# Altium schematic sheet pcuOut.SchDoc
size A3
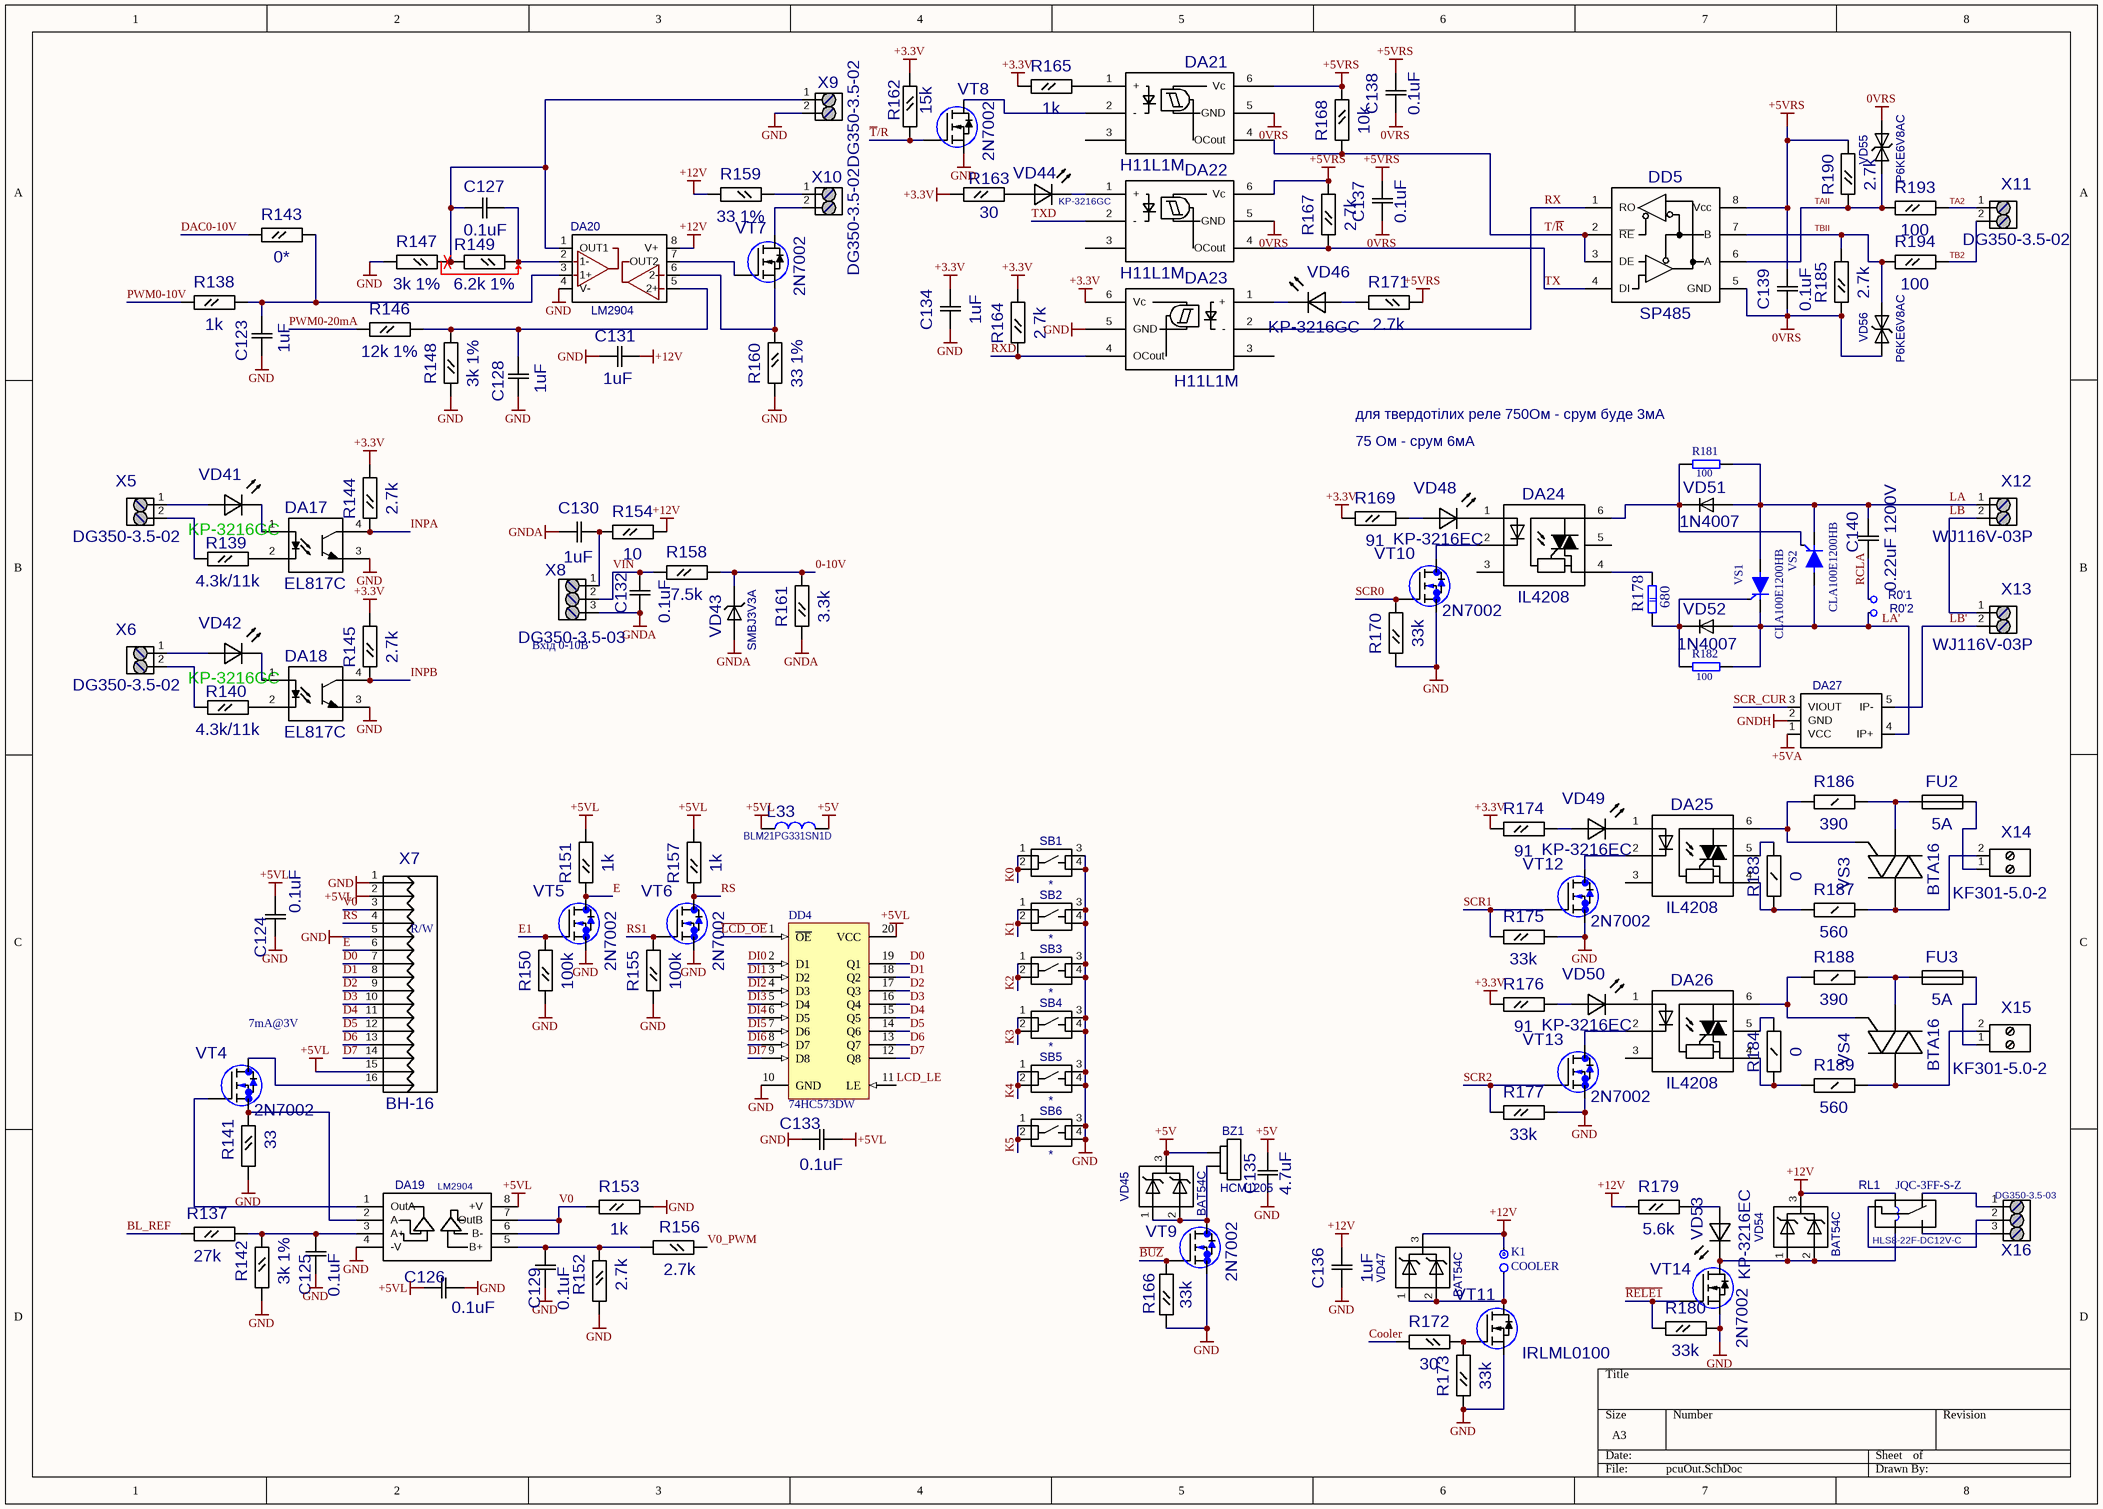
[diagram p0: pcuOut.SchDoc]

## Parts
BZ1  HCM1205  [D12_P7-62]
C123  value 1uF  [C0805]  (hidden comment: C0805)
C124  value 0.1uF  [C0805]  (hidden comment: C0805)
C125  value 0.1uF  [C0805]  (hidden comment: C0805)
C126  value 0.1uF  [C0805]  (hidden comment: C0805)
C127  value 0.1uF  [C0805]  (hidden comment: C0805)
C128  value 1uF  [C0805]  (hidden comment: C0805)
C129  value 0.1uF  [C0805]  (hidden comment: C0805)
C130  value 1uF  [C0805]  (hidden comment: C0805)
C131  value 1uF  [C0805]  (hidden comment: C0805)
C132  value 0.1uF  [C0805]  (hidden comment: C0805)
C133  value 0.1uF  [C0805]  (hidden comment: C0805)
C134  value 1uF  [C0805]  (hidden comment: C0805)
C135  value 4.7uF  [C1206]  (hidden comment: C1206)
C136  value 1uF  [C0805]  (hidden comment: C0805)
C137  value 0.1uF  [C0805]  (hidden comment: C0805)
C138  value 0.1uF  [C0805]  (hidden comment: C0805)
C139  value 0.1uF  [C0805]  (hidden comment: C0805)
C140  0.22uF 1200V  [CBB21]
DA17  EL817C  [DIL4SMD]
DA18  EL817C  [DIL4SMD]
DA19  value LM2904  [SO8-150]  (hidden comment: LM358D)
DA20  LM2904  [SO8-1.27]
DA21  H11L1M  [DIP6_SURFACE]
DA22  H11L1M  [DIP6_SURFACE]
DA23  H11L1M  [DIP6_SURFACE]
DA24  IL4208  [DIP6]
DA25  IL4208  [DIP6]
DA26  IL4208  [DIP6]
DA27  ACS758  [CB]  (value not drawn)
DD4  74HC573DW  [DW020_N]
DD5  SP485  [SO8-150]
FU2  value 5A  [FU_5x20]  (hidden comment: FUSE-D5)
FU3  value 5A  [FU_5x20]  (hidden comment: FUSE-D5)
K1  COOLER  [J1x2]
L33  BLM21PG331SN1D  [R0805]
R0'1  1mm  [PCB_hole_1mm]  (value not drawn)
R0'2  1mm  [PCB_hole_1mm]  (value not drawn)
R137  value 27k  [R0805]  (hidden comment: R0805)
R138  value 1k  [R0805]  (hidden comment: R0805)
R139  value 4.3k/11k  [R0805]  (hidden comment: R0805)
R140  value 4.3k/11k  [R0805]  (hidden comment: R0805)
R141  value 33  [R0805]  (hidden comment: R0805)
R142  value 3k 1%  [R0805]  (hidden comment: R0805)
R143  value 0*  [R0805]  (hidden comment: R0805)
R144  value 2.7k  [R0805]  (hidden comment: R0805)
R145  value 2.7k  [R0805]  (hidden comment: R0805)
R146  value 12k 1%  [R0805]  (hidden comment: R0805)
R147  value 3k 1%  [R0805]  (hidden comment: R0805)
R148  value 3k 1%  [R0805]  (hidden comment: R0805)
R149  value 6.2k 1%  [R0805]  (hidden comment: R0805)
R150  value 100k  [R0805]  (hidden comment: R0805)
R151  value 1k  [R0805]  (hidden comment: R0805)
R152  value 2.7k  [R0805]  (hidden comment: R0805)
R153  value 1k  [R0805]  (hidden comment: R0805)
R154  value 10  [R0805]  (hidden comment: R0805)
R155  value 100k  [R0805]  (hidden comment: R0805)
R156  value 2.7k  [R0805]  (hidden comment: R0805)
R157  value 1k  [R0805]  (hidden comment: R0805)
R158  value 7.5k  [R0805]  (hidden comment: R0805)
R159  value 33 1%  [R0805]  (hidden comment: R0805)
R160  value 33 1%  [R0805]  (hidden comment: R0805)
R161  value 3.3k  [R0805]  (hidden comment: R0805)
R162  value 15k  [R0805]  (hidden comment: R0805)
R163  value 30  [R0805]  (hidden comment: R0805)
R164  value 2.7k  [R0805]  (hidden comment: R0805)
R165  value 1k  [R0805]  (hidden comment: R0805)
R166  value 33k  [R0805]  (hidden comment: R0805)
R167  value 2.7k  [R0805]  (hidden comment: R0805)
R168  value 10k  [R0805]  (hidden comment: R0805)
R169  value 91  [R0805]  (hidden comment: R0805)
R170  value 33k  [R0805]  (hidden comment: R0805)
R171  value 2.7k  [R0805]  (hidden comment: R0805)
R172  value 30  [R0805]  (hidden comment: R0805)
R173  value 33k  [R0805]  (hidden comment: R0805)
R174  value 91  [R0805]  (hidden comment: R0805)
R175  value 33k  [R0805]  (hidden comment: R0805)
R176  value 91  [R0805]  (hidden comment: R0805)
R177  value 33k  [R0805]  (hidden comment: R0805)
R178  680  [R2W CF-700]
R179  value 5.6k  [R0805]  (hidden comment: R0805)
R180  value 33k  [R0805]  (hidden comment: R0805)
R181  100  [R0.5-400]
R182  100  [R0.5-400]
R183  value 0  [R1206]  (hidden comment: R1206)
R184  value 0  [R1206]  (hidden comment: R1206)
R185  value 2.7k  [R0805]  (hidden comment: R0805)
R186  value 390  [R1206]  (hidden comment: R1206)
R187  value 560  [R1206]  (hidden comment: R1206)
R188  value 390  [R1206]  (hidden comment: R1206)
R189  value 560  [R1206]  (hidden comment: R1206)
R190  value 2.7k  [R0805]  (hidden comment: R0805)
R193  value 100  [R0805]  (hidden comment: R0805)
R194  value 100  [R0805]  (hidden comment: R0805)
RL1  value HLS8-22F-DC12V-C  [RELAY833]  (hidden comment: RELEY833)
SB1  *  [DTSM-6]
SB2  *  [DTSM-6]
SB3  *  [DTSM-6]
SB4  *  [DTSM-6]
SB5  *  [DTSM-6]
SB6  *  [DTSM-6]
VD41  KP-3216GC  [KP-3216 Hole]
VD42  KP-3216GC  [KP-3216 Hole]
VD43  value SMBJ3V3A  [DO-214AA(SMB)]  (hidden comment: 10BQ100)
VD44  KP-3216GC  [KP-3216]
VD45  BAT54C  [SOT23-1]
VD46  KP-3216GC  [KP-3216]
VD47  BAT54C  [SOT23-1]
VD48  KP-3216EC  [KP-3216]
VD49  KP-3216EC  [KP-3216]
VD50  KP-3216EC  [KP-3216]
VD51  value 1N4007  [DIOD_Wsmall_bigholes]  (hidden comment: DIOD)
VD52  value 1N4007  [DIOD_Wsmall_bigholes]  (hidden comment: DIOD)
VD53  KP-3216EC  [KP-3216 Hole]
VD54  BAT54C  [SOT23-1]
VD55  value P6KE6V8AC  [DIOD_small_bigholes]  (hidden comment: P6KE___C)
VD56  value P6KE6V8AC  [DIOD_small_bigholes]  (hidden comment: P6KE___C)
VS1  CLA100E1200HB  [TO247-RA-800a]
VS2  CLA100E1200HB  [TO247-RA-800a]
VS3  value BTA16  [TO220-RB-600]  (hidden comment: TRIAC)
VS4  value BTA16  [TO220-RB-600]  (hidden comment: TRIAC)
VT4  2N7002  [SOT23-1]
VT5  2N7002  [SOT23-1]
VT6  2N7002  [SOT23-1]
VT7  2N7002  [SOT23-1]
VT8  2N7002  [SOT23-1]
VT9  2N7002  [SOT23-1]
VT10  2N7002  [SOT23-1]
VT11  IRLML0100  [SOT23-1]
VT12  2N7002  [SOT23-1]
VT13  2N7002  [SOT23-1]
VT14  2N7002  [SOT23-1]
X5  DG350-3.5-02  [DG350-3.5-02 SLIM]
X6  DG350-3.5-02  [DG350-3.5-02 SLIM]
X7  BH-16  [BH-16]
X8  DG350-3.5-03  [DG350-3.5-03]
X9  DG350-3.5-02  [DG350-3.5-02]
X10  DG350-3.5-02  [DG350-3.5-02]
X11  DG350-3.5-02  [DG350-3.5-02 SLIM]
X12  WJ116V-03P  [WJ116V]
X13  WJ116V-03P  [WJ116V]
X14  KF301-5.0-2  [KF301-5.0-2]
X15  KF301-5.0-2  [KF301-5.0-2]
X16  DG350-3.5-03  [DG350-3.5-03 slim]

## Nets
0VRS: C137.1 C138.1 C139.1 DA21.5(GND) DA22.5(GND) DD5.5(GND) R185.2 VD55.2 VD56.2
+3.3V: C134.2 DA23.6(Vc) R144.1 R145.1 R162.2 R163.2 R164.1 R165.2 R169.2 R174.2 R176.2
+5V: BZ1.1 C135.2 L33.2 VD45.3
+5VA: DA27.1(VCC)
+5VL: C124.1 C126.2 C133.1 DA19.8(+V) DD4.20(VCC) L33.1 R151.1 R157.1 X7.2 X7.15
+5VRS: C137.2 C138.2 C139.2 DA21.6(Vc) DA22.6(Vc) DD5.8(Vcc) R167.1 R168.2 R171.2 R190.1
+12V: C131.2 C136.2 DA20.8(V+) K1.1 R154.1 R159.1 R179.2 RL1.5 VD47.3 VD54.3
GND: C123.1 C124.2 C125.1 C126.1 C128.1 C129.1 C131.1 C133.2 C134.1 C135.1 C136.1 DA17.3(E) DA18.3(E) DA19.4(-V) DA20.4(V-) DA23.5(GND) DD4.10(GND) R141.1 R142.1 R147.1 R148.2 R150.2 R152.1 R153.1 R155.2 R160.1 R166.2 R170.2 R173.2 R175.1 R177.1 R180.1 SB1.3 SB1.4 SB2.3 SB2.4 SB3.3 SB3.4 SB4.3 SB4.4 SB5.3 SB5.4 SB6.3 SB6.4 VT5.2(S) VT6.2(S) VT8.2(S) VT9.2(S) VT10.2(S) VT11.2(S) VT12.2(S) VT13.2(S) VT14.2(S) X7.1 X7.5 X9.2
GNDA: C130.1 C132.2 R161.2 VD43.2 X8.3
GNDH: DA27.2(GND)
0-10V: R158.1 R161.1 VD43.1
~{BUZ}: R166.1 VT9.1(G)
~{LCD_OE}: DD4.1(~{OE})
~{RELE1}: R180.2 VT14.1(G)
BL_REF: R137.2
Cooler: R172.1
D0: DD4.19(Q1) X7.7
D1: DD4.18(Q2) X7.8
D2: DD4.17(Q3) X7.9
D3: DD4.16(Q4) X7.10
D4: DD4.15(Q5) X7.11
D5: DD4.14(Q6) X7.12
D6: DD4.13(Q7) X7.13
D7: DD4.12(Q8) X7.14
DAC0-10V: R143.2
DI0: DD4.2(D1)
DI1: DD4.3(D2)
DI2: DD4.4(D3)
DI3: DD4.5(D4)
DI4: DD4.6(D5)
DI5: DD4.7(D6)
DI6: DD4.8(D7)
DI7: DD4.9(D8)
E: R151.2 VT5.3(D) X7.6
E1: R150.1 VT5.1(G)
INPA: DA17.4(C) R144.2
INPB: DA18.4(C) R145.2
K0: SB1.1 SB1.2
K1: SB2.1 SB2.2
K2: SB3.1 SB3.2
K3: SB4.1 SB4.2
K4: SB5.1 SB5.2
K5: SB6.1 SB6.2
LA: C140.2 R181.2 VD51.2(+) VS1.2(A) VS2.1(C) X12.1
LA': DA27.4(IP+) R0'2.?1 R182.2 VD52.2(+) VS1.1(C) VS2.2(A)
LB: X12.2 X13.1
LB': DA27.5(IP-) X13.2
LCD_LE: DD4.11(LE)
PWM0-10V: R138.2
PWM0-20mA: R146.2
RCLA: C140.1 R0'1.?1
RS: R157.2 VT6.3(D) X7.4
RS1: R155.1 VT6.1(G)
RX: DA23.2(-) DD5.1(RO)
RXD: DA23.4(OCout) R164.2
SCR0: R170.1 VT10.1(G)
SCR1: R175.2 VT12.1(G)
SCR2: R177.2 VT13.1(G)
SCR_CUR: DA27.3(VIOUT)
T/~{R}: DA21.4(OCout) DD5.2(~{RE}) DD5.3(DE) R168.1
~{T}/R: R162.1 VT8.1(G)
TA2: R193.1 X11.1
TAII: DD5.6(A) R190.2 R193.2 VD55.1
TB2: R194.1 X11.2
TBII: DD5.7(B) R185.1 R194.2 VD56.1
TX: DA22.4(OCout) DD5.4(DI) R167.2
TXD: DA22.2(-)
V0: DA19.6(B-) DA19.7(OutB) R153.2 X7.3
V0_PWM: R156.2
VIN: C132.1 R158.2 X8.2
NetBZ1_2: BZ1.2 VD45.1 VD45.2 VT9.3(D)
NetC123_2: C123.2 DA20.3(1+) R138.1 R143.1
NetC125_2: C125.2 DA19.3(A+) R137.1 R142.2
NetC127_1: C127.1 DA20.1(OUT1) R147.2 R149.1 X9.1
NetC127_2: C127.2 DA20.2(1-) R149.2
NetC128_2: C128.2 DA20.5(2+) R146.1 R148.1
NetC129_2: C129.2 DA19.5(B+) R152.2 R156.1
NetC130_2: C130.2 R154.2 X8.1
NetDA17_1: DA17.1(+) VD41.2
NetDA17_2: DA17.2(-) R139.1
NetDA18_1: DA18.1(+) VD42.2
NetDA18_2: DA18.2(-) R140.1
NetDA19_1: DA19.1(OutA) VT4.1(G)
NetDA19_2: DA19.2(A-) R141.2 VT4.2(S)
NetDA20_6: DA20.6(2-) R160.2 VT7.2(S)
NetDA20_7: DA20.7(OUT2) VT7.1(G)
NetDA21_1: DA21.1(+) R165.1
NetDA21_2: DA21.2(-) VT8.3(D)
NetDA22_1: DA22.1(+) VD44.2
NetDA23_1: DA23.1(+) VD46.2
NetDA24_1: DA24.1 VD48.2
NetDA24_2: DA24.2 VT10.3(D)
NetDA24_4: DA24.4 R178.2
NetDA24_6: DA24.6 R181.1 VD51.1(-) VS2.3(G)
NetDA25_1: DA25.1 VD49.2
NetDA25_2: DA25.2 VT12.3(D)
NetDA25_4: DA25.4 R183.2 R187.2
NetDA25_5: DA25.5 R183.1
NetDA25_6: DA25.6 R186.2 VS3.3(G)
NetDA26_1: DA26.1 VD50.2
NetDA26_2: DA26.2 VT13.3(D)
NetDA26_4: DA26.4 R184.2 R189.2
NetDA26_5: DA26.5 R184.1
NetDA26_6: DA26.6 R188.2 VS4.3(G)
NetFU2_1: FU2.1 R186.1 VS3.1(A1)
NetFU2_2: FU2.2 X14.1
NetFU3_1: FU3.1 R188.1 VS4.1(A1)
NetFU3_2: FU3.2 X15.1
NetK1_2: K1.2 VD47.1 VD47.2 VT11.3(D)
NetR139_2: R139.2 X5.2
NetR140_2: R140.2 X6.2
NetR159_2: R159.2 X10.1
NetR163_1: R163.1 VD44.1
NetR169_1: R169.1 VD48.1
NetR171_1: R171.1 VD46.1
NetR172_2: R172.2 R173.1 VT11.1(G)
NetR174_1: R174.1 VD49.1
NetR176_1: R176.1 VD50.1
NetR178_1: R178.1 R182.1 VD52.1(-) VS1.3(G)
NetR179_1: R179.1 VD53.1
NetR187_1: R187.1 VS3.2(A2) X14.2
NetR189_1: R189.1 VS4.2(A2) X15.2
NetRL1_1: RL1.1 X16.2
NetRL1_2: RL1.2 X16.3
NetRL1_3: RL1.3 X16.1
NetRL1_4: RL1.4 VD53.2 VD54.1 VD54.2 VT14.3(D)
NetVD41_1: VD41.1 X5.1
NetVD42_1: VD42.1 X6.1
NetVT4_3: VT4.3(D) X7.16
NetVT7_3: VT7.3(D) X10.2

Not connected (* = marked no-connect by the designer): DA21 3; DA22 3; DA23 3; DA24 3 5; DA25 3; DA26 3

## Notes on the sheet
- 75 Ом - срум 6мА
- (near R181) для твердотілих реле 750Ом - срум буде 3мА
- (near X8) Вхід 0-10В
- (near X7) R/W
- (near VT4) 7mA@3V
- (near RL1) JQC-3FF-S-Z

## Library data of the parts
C123-C134 C136-C139 = C0805: RefDes2: {RefDes2}
C135 = C1206: RefDes2: {RefDes2}
C140 = Cap: CBB21; RefDes2: {RefDes2}
DA17 DA18 = PC817: optocuple; Value: EL817C
DA20 = LM2904: LM2903; Value: *
DA21-DA23 = H11L1M: RefDes2: {RefDes2}
DA24-DA26 = IL410: RefDes2: {RefDes2}; Value: IL4208
DD4 = 74HC573DW: Octal D-Type Transparent Latch with 3-State Outputs; Published: 8-Jun-2000; LatestRevisionDate: 13-Apr-2006; LatestRevisionNote: IPC-7351 Footprint Added.; DatasheetVersion: Jun-1989; PackageVersion: Mar-2000; PackageReference: DW020; Publisher: Altium Limited; PackageDescription: 20-Pin Plastic Small Outline Integrated Circuit 1.27 mm Pitch; Code_JEDEC: MS-013; Code_IPC: SOIC127P1030-20; ComponentLink1Description: Manufacturer Link; ComponentLink1URL: http://www.ti.com/
DD5 = SP485: RS485; RefDes2: {RefDes2}; Value: SP485
FU2 FU3 = FUSE-D5: Fuse
K1 = H-1x2
L33 = BLM21PG331SN1D: Ferrite beads; Value: BLM21PG331SN1D
R0'1 R0'2 = PCB_1H: PCB_1R
R137-R177 R179 R180 R185 R190 R193 R194 = R0805: RefDes2: {RefDes2}
R178 = R-2W CF: 2W 5% 500V; Price: 0.1; Value: 680
R181 R182 = R-0.5W: 0.5W 5% 350V; Value: 100; Price: 0.01
R183 R184 R186-R189 = R1206: RefDes2: {RefDes2}
SB1-SB6 = TACT: Value: *
VD41 VD42 VD44 VD46 VD48-VD50 VD53 = KP-3216EC: RefDes2: {RefDes2}
  VD44 VD46: Value: KP-3216GC
VD43 = 10BQ100: RefDes2: {RefDes2}
VD51 VD52 = DIOD: RefDes2: {RefDes2}
VD55 VD56 = P6KE___C: RefDes2: {RefDes2}
VS1 VS2 = Tirystor: Value: *
VT11 = 2N7002: Value: IRLML0100
X5 X6 X9-X11 = DG350-3.5-02: RefDes2: {RefDes2}
X7 = BH-16: RefDes2: {RefDes2}
X8 X16 = DG350-3.5-03: 3.5mm 3pins; Value: DG350-3.5-03
X12 X13 = WJ116V-03P: RefDes2: {RefDes2}
X14 X15 = KF301-5.0-2: 5mm 2pins; RefDes2: {RefDes2}
BZ1 = HCM1205: Value: *
DA27 = ACS758: Value: *